# Altium schematic sheet encoder.SchDoc
size A4; Organization: Altium Limited; Address1: L3, 12a Rodborough Rd; Address2: Frenchs Forest; Address3: NSW; Address4: Australia 2086; DocumentNumber: 4; SheetNumber: 4; SheetTotal: 4
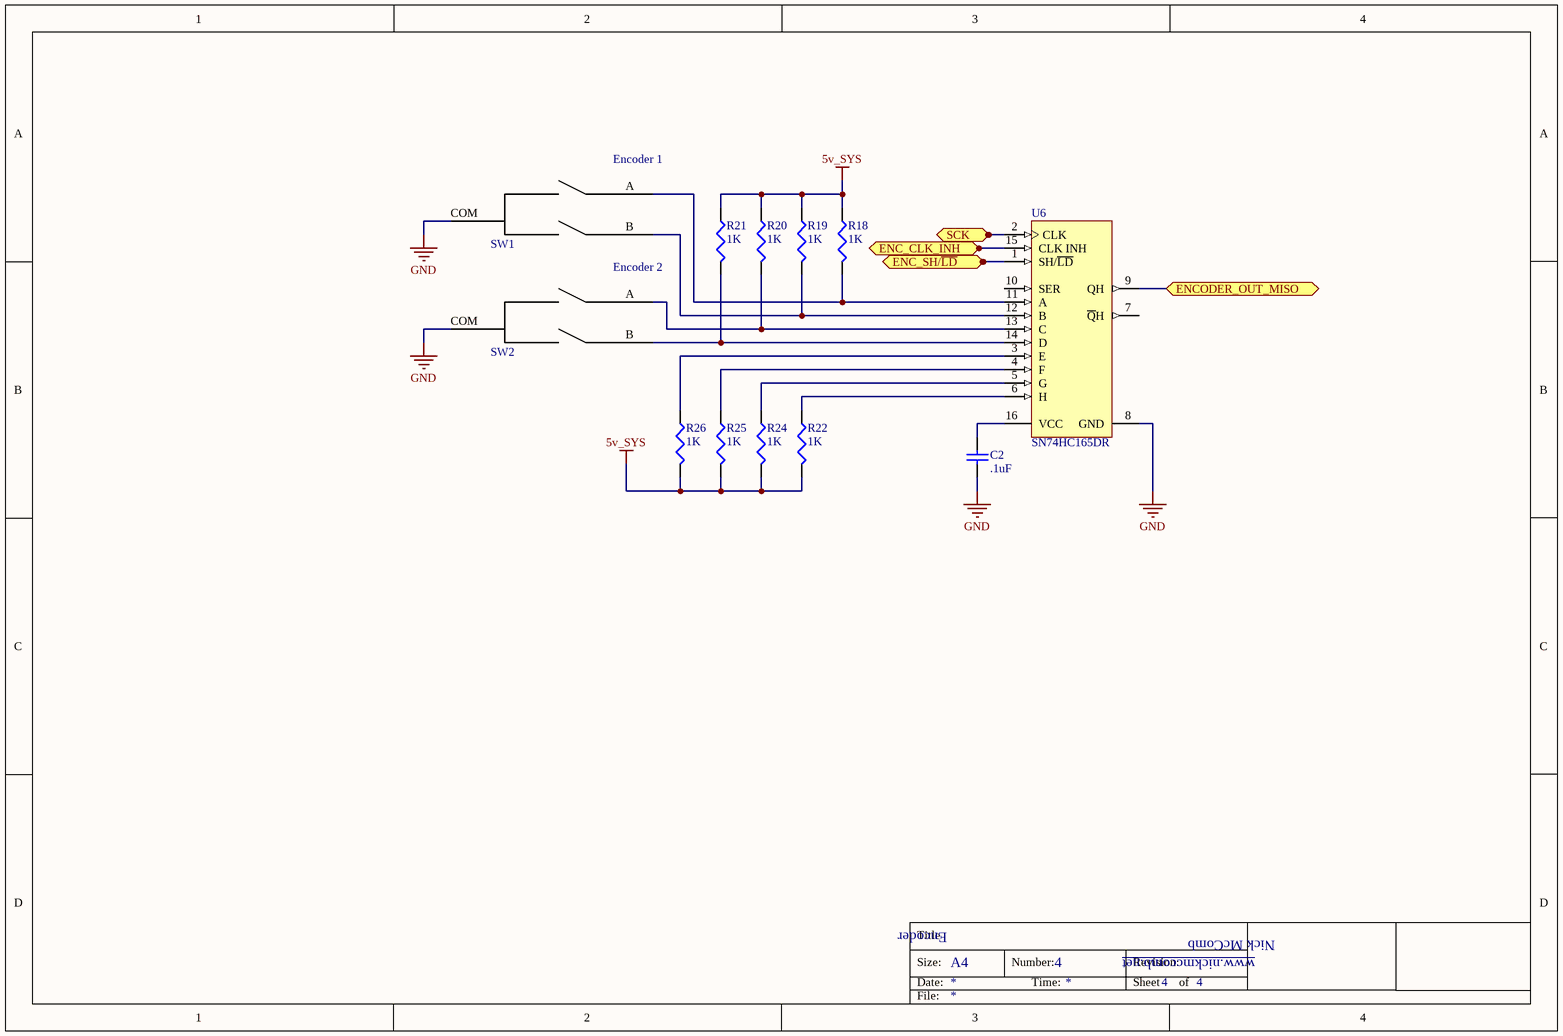
[diagram p0: encoder.SchDoc]

## Parts
C2  value .1uF  [C0805]  (hidden comment: 0805 style, by default)
R18  1K  [J1-0603]
R19  1K  [J1-0603]
R20  1K  [J1-0603]
R21  1K  [J1-0603]
R22  1K  [J1-0603]
R24  1K  [J1-0603]
R25  1K  [J1-0603]
R26  1K  [J1-0603]
SW1  ENCODER  (value not drawn)
SW2  ENCODER  (value not drawn)
U6  SN74HC165DR  [D0016A_L]

## Ports
ENC_CLK_INH, ENC_SH/~{LD}, ENCODER_OUT_MISO, SCK

## Nets
5v_SYS: R18.2 R19.2 R20.2 R21.2 R22.1 R24.1 R25.1 R26.1
GND: C2.1 SW1.COM SW2.COM U6.8(GND)
ENC_CLK_INH: U6.15(CLK_INH) ; port ENC_CLK_INH
ENC_SH/~{LD}: U6.1(SH/~{LD}) ; port ENC_SH/~{LD}
ENCODER_OUT_MISO: U6.9(QH) ; port ENCODER_OUT_MISO
SCK: U6.2(CLK) ; port SCK
NetC2_2: C2.2 U6.16(VCC)
NetR18_1: R18.1 SW1.A U6.11(A)
NetR19_1: R19.1 SW1.B U6.12(B)
NetR20_1: R20.1 SW2.A U6.13(C)
NetR21_1: R21.1 SW2.B U6.14(D)
NetR22_2: R22.2 U6.6(H)
NetR24_2: R24.2 U6.5(G)
NetR25_2: R25.2 U6.4(F)
NetR26_2: R26.2 U6.3(E)

Not connected (* = marked no-connect by the designer): U6 7(~{Q}H) 10(SER)

## Notes on the sheet
- (near SW1) Encoder 1
- Encoder 2
- Encoder
- Title
- Size:
- Date:
- A4
- Number:
- Time:
- Revision:
- Sheet
- of
- www.nickmccomb.net
- Nick McComb
- File:

## Library data of the parts
C2 = Cap: Capacitor; Published: 8-Jun-2000; LatestRevisionDate: 17-Jul-2002; LatestRevisionNote: Re-released for DXP Platform.; PackageReference: RAD-0.3; Publisher: Altium Limited; PackageDescription: Radial Cap, Thru-Hole; 2 Leads; 0.3 in Pin Spacing
R18-R22 R24-R26 = Res3: Resistor; Published: 8-Jun-2000; LatestRevisionDate: 29-May-2009; LatestRevisionNote: IPC-7351 Footprint Added.; PackageReference: J1-0603; Publisher: Altium Limited; PackageDescription: Chip Resistor; Value: 1K
U6 = CMP-0780-00020-1: 8-Bit Parallel-Load Shift Registers, D0016A, LARGE T&R; F @ Nom Voltage(Max)(Mhz): 28; Rating: Catalog; VCC(Max)(V): 6; VCC(Min)(V): 2; tpd @ Nom Voltage(Max)(ns): 38; Output Drive (IOL/IOH)(Max)(mA): 5.2/-5.2; Bits: 8; 3-State Output: No; Output Type: CMOS; ICC @ Nom Voltage(Max)(mA): 0.08; Technology Family: HC; Operating Temperature Range(C): -40 to 125; PartNumber: SN74HC165DR; Code_IPC: MS-012 variation AC; PackageReference: D0016A; ComponentLink1Description: Manufacturer URL; ComponentLink2URL: http://www.ti.com/lit/ds/symlink/sn74hc165.pdf; Input Type: CMOS; ComponentLink2Description: Datasheet; PackageVersion: http://www.ti.com/lit/ml/mpds178g/mpds178g.pdf; Part Number: SN74HC165; ComponentLink1URL: http://www.ti.com/; Voltage(Nom)(V): 6; DatasheetVersion: SCLS116G